# Altium schematic sheet Schematic_Rev13.SchDoc
size A2; Author: #; CompanyName: OMNITECH ELECTRONICS INCORPORATED; Engineer: SL; Organization: Omnitech Electronics Inc.; Address1: 10 Akerley Blvd, Dartmouth, Nova Scotia, Canada B3B 1J4; Address2: (902) 468-5911, FAX (902) 468-5911; Address3: www.omnitechelectronics.ca; Revision: A; SheetNumber: 1; SheetTotal: 1; PrjEngineer: SL; PrjStartDate: 04/11/2012; PrjDrawnBy: MR; PrjRevision: A; JobNumber: 2375; PrjTitle: Flow Rate Totalizing Meter; Title2: Display Board LED/Buttons; PrjCheckedBy: SL; PrjDocumentNumber: 2375-E-002; PageSetup: Record=PageOptions|CenterHorizontal=True|CenterVertical=True|PrintScale=0.67|XCorrection=1.00|YCorrection=1.00|PrintKind=1|BorderSize=5000000|LeftOffset=0|BottomOffset=0|Orientation=2|PaperLength=1000|PaperWidth=1000|Scale=100|PaperSource=257|PrintQuality=600|MediaType=1|DitherType=10|PaperKind=11x17|PrintScaleMode=1; PrjCustomer: Omnitech Inc.
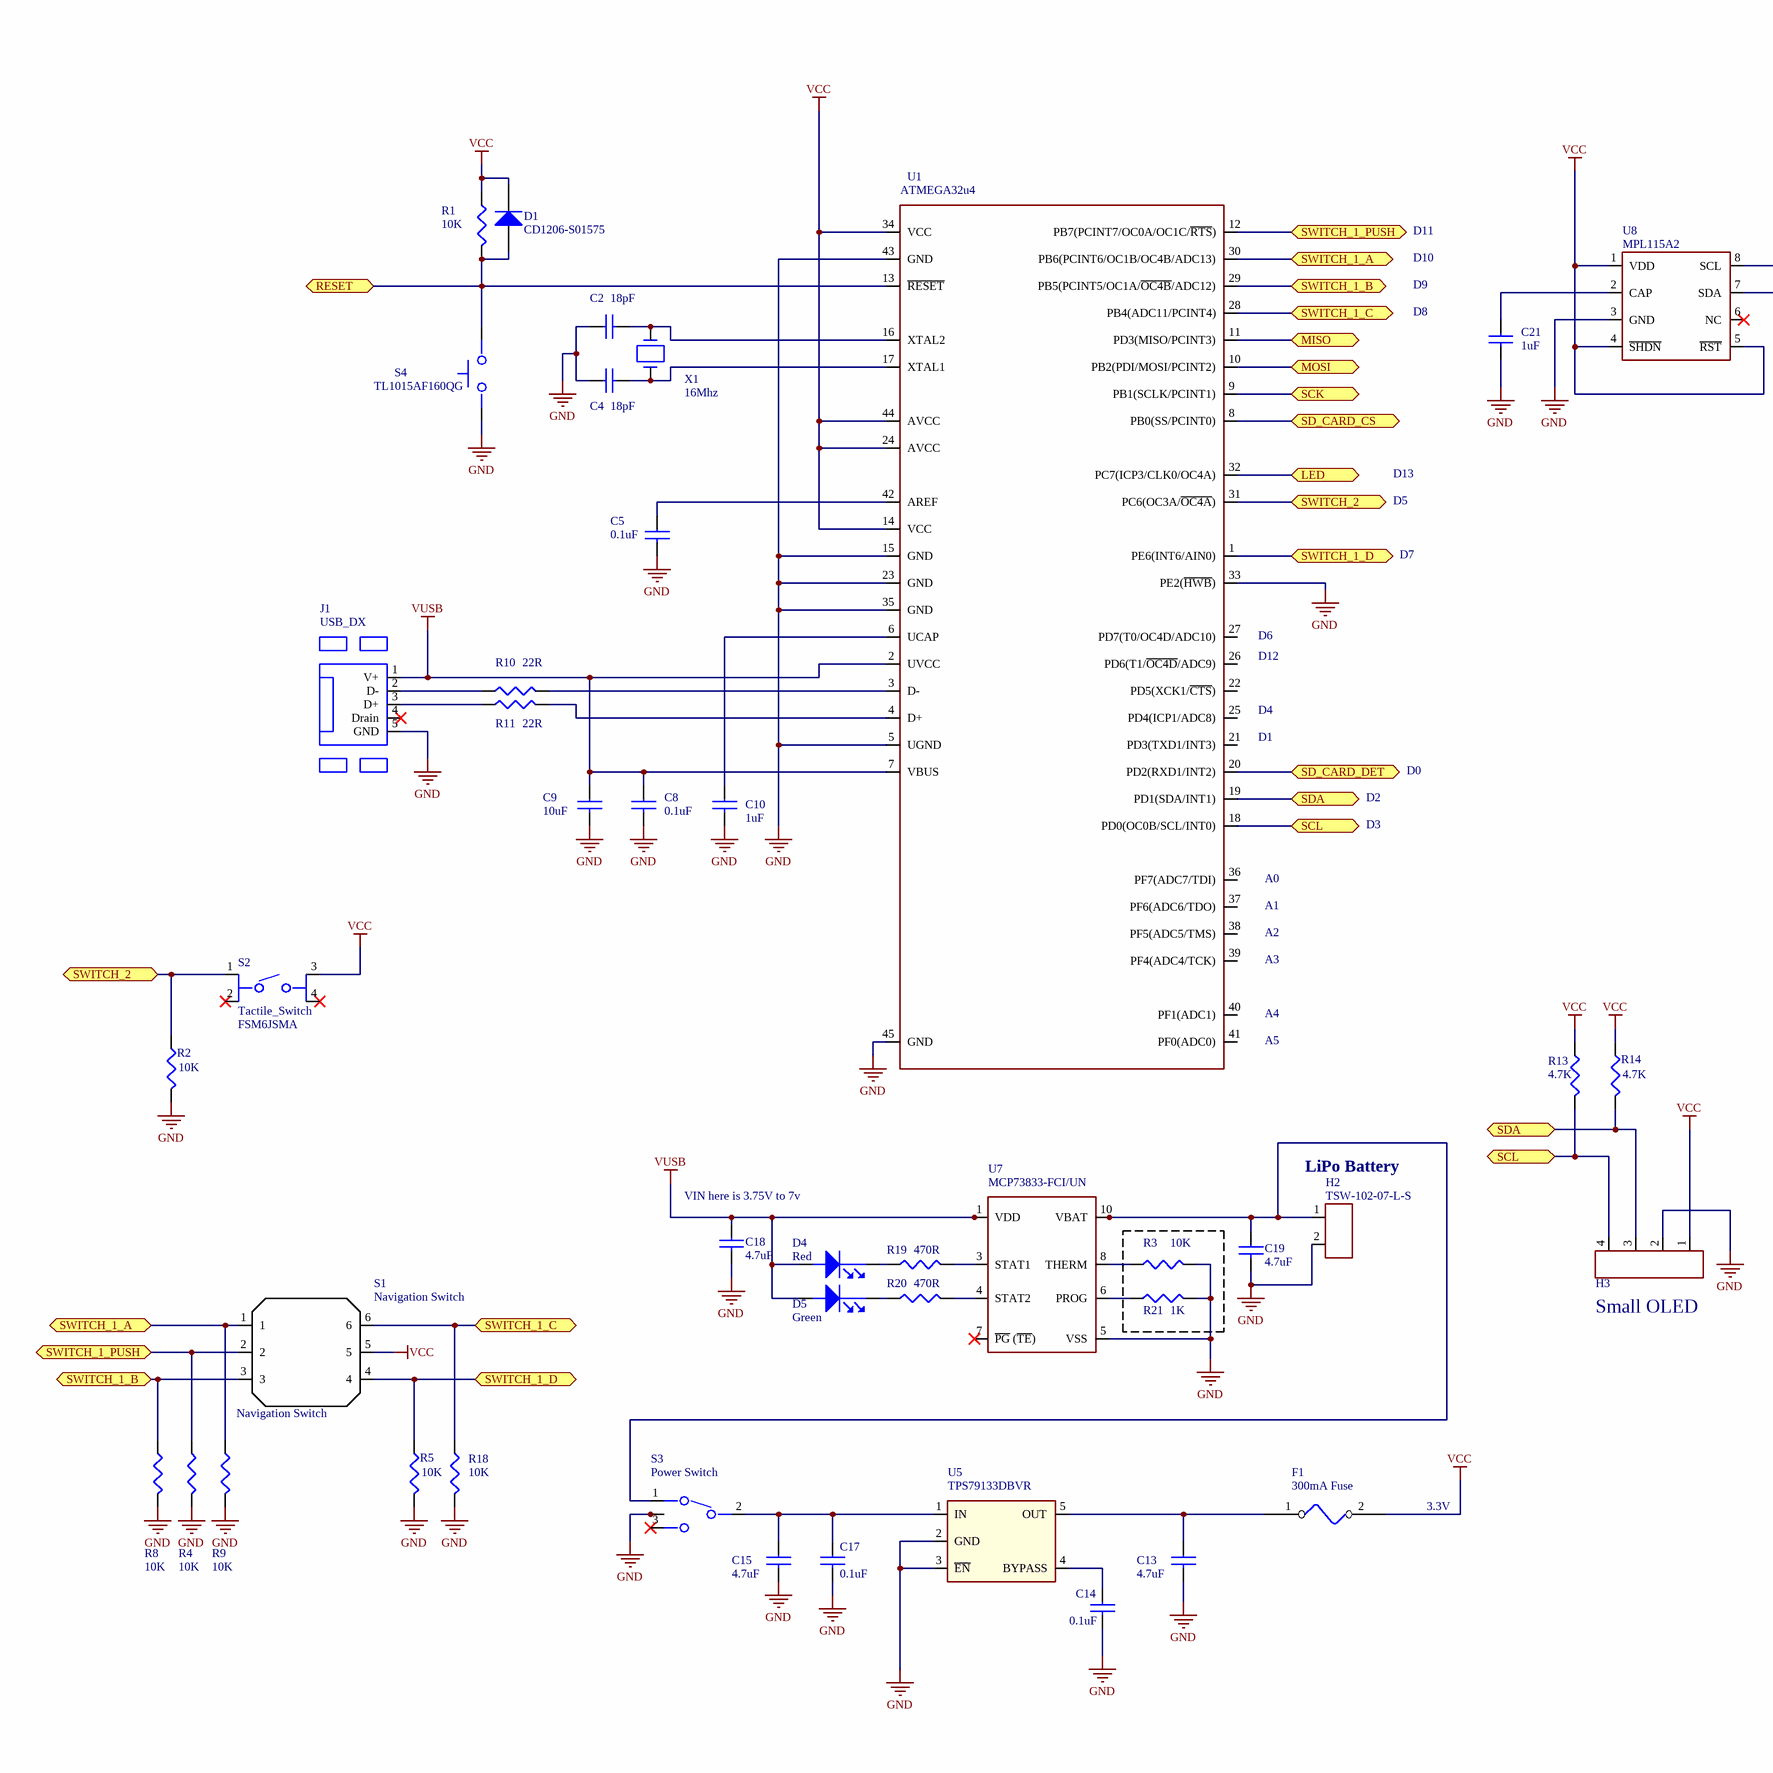
[diagram p0: Schematic_Rev13.SchDoc, left]
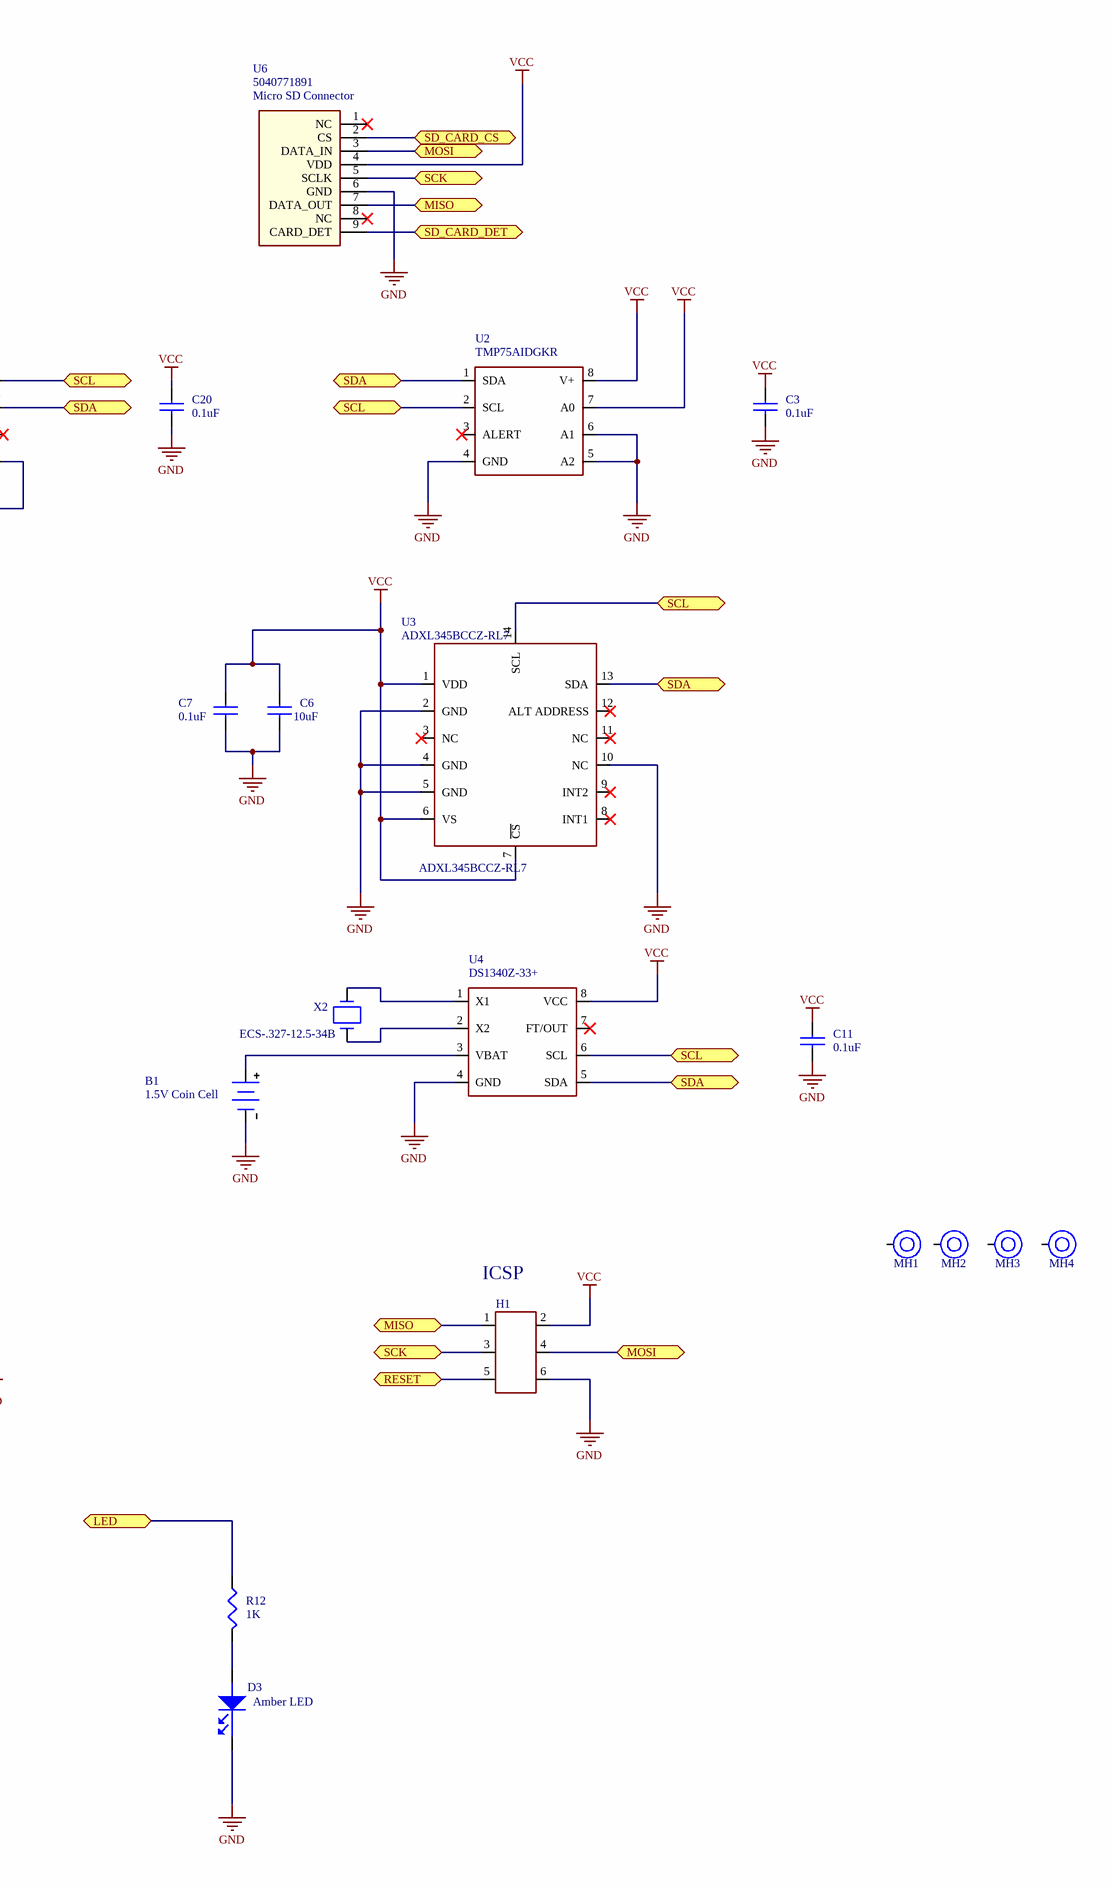
[diagram p1: Schematic_Rev13.SchDoc, right]

## Parts
B1  value 1.5V Coin Cell  [CR377 Mount]  (hidden comment: CR377)
C2  18pF  [CAPC1608X90N]
C3  0.1uF  [CAPC1608X90N]
C4  18pF  [CAPC1608X90N]
C5  0.1uF  [CAPC1608X90N]
C6  10uF  [CAPC3216X160N]
C7  0.1uF  [CAPC1608X90N]
C8  0.1uF  [CAPC1608X90N]
C9  10uF  [CAPC3216X160N]
C10  1uF  [CAPC1608X90N]
C11  0.1uF  [CAPC1608X90N]
C13  value 4.7uF  [CHIP_3216N]  (hidden comment: CAP_1206)
C14  0.1uF  [CHIP_1608N]
C15  value 4.7uF  [CHIP_3216N]  (hidden comment: CAP_1206)
C17  0.1uF  [CHIP_1608N]
C18  4.7uF  [CAPC3216X160N]
C19  4.7uF  [CAPC3216X160N]
C20  0.1uF  [CAPC1608X90N]
C21  1uF  [CAPC1608X90N]
D1  CD1206-S01575  [BOUR-CD1206-S01575-2_L]
D3  Amber LED  [LED1608X55N-RED]
D4  PartNumber: Red  [LED1608X55N-GREEN]  (hidden comment: LED_0603)
D5  PartNumber: Green  [LED1608X55N-GREEN]  (hidden comment: LED_0603)
F1  300mA Fuse  [RESC1608X55N]
H1  CON3X2  [HDR3X2]  (value not drawn)
H2  TSW-102-07-L-S  [HDR1X2]
H3  CON4  [HDR1X4-Empty]  (value not drawn)
J1  USB_DX  [USB_DX]
MH1  Mounting Hole  [MH - 128mil Hole, 250mil Pad]  (value not drawn)  (no BOM)
MH2  Mounting Hole  [MH - 128mil Hole, 250mil Pad]  (value not drawn)  (no BOM)
MH3  Mounting Hole  [MH - 128mil Hole, 250mil Pad]  (value not drawn)  (no BOM)
MH4  Mounting Hole  [MH - 128mil Hole, 250mil Pad]  (value not drawn)  (no BOM)
R1  10K  [RESC1608X55N]
R2  10K  [RESC1608X55N]
R3  10K  [RESC1608X55N]
R4  10K  [RESC1608X55N]
R5  10K  [RESC1608X55N]
R8  10K  [RESC1608X55N]
R9  10K  [RESC1608X55N]
R10  22R  [RESC1608X55N]
R11  22R  [RESC1608X55N]
R12  1K  [RESC1608X55N]
R13  4.7K  [RESC1608X55N]
R14  4.7K  [RESC1608X55N]
R18  10K  [RESC1608X55N]
R19  470R  [RESC1608X55N]
R20  470R  [RESC1608X55N]
R21  1K  [RESC1608X55N]
S1  Navigation Switch  [NAVIGATION - DX]
S2  Tactile_Switch  value FSM6JSMA  [FSM6JSMA]
S3  (no value)  [SLIDE_SWITCH_DX]
S4  TL1015AF160QG  [TL1015AF160QG]
U1  ATMEGA32u4  [VQFN-44]
U2  TMP75AIDGKR  [MSOP-8N - NOPAD]
U3  ADXL345BCCZ-RL7  [LGA80P300X500X100-14N]
U4  DS1340Z-33+  [TSOP65P490X110-8N]
U5  TPS79133DBVR  [SOT95P280X144-5N]
U6  Micro SD Connector  [5040771891]
U7  MCP73833-FCI/UN  [TSSOP50P490X110-10N]
U8  MPL115A2  [8-LGA]
X1  16Mhz  [OSC320X250X75-4N]
X2  ECS-.327-12.5-34B  [ECS-.327-12.5-34B]

## Ports
LED (bidir), MISO (bidir), MOSI (bidir), RESET (bidir), SCK (bidir), SCL (bidir), SD_CARD_CS (bidir), SD_CARD_DET (bidir), SDA (bidir), SWITCH_1_A, SWITCH_1_B, SWITCH_1_C, SWITCH_1_D, SWITCH_1_PUSH, SWITCH_2

## Nets
GND: B1.2(-) C2.1 C3.2 C4.1 C5.2 C6.2 C7.2 C8.2 C9.2 C10.2 C11.2 C13.2 C14.2 C15.2 C17.2 C18.2 C19.2 C20.2 C21.2 D3.1(CATHODE) H1.6 H2.2 H3.2 J1.5(GND) R2.2 R3.2 R4.2 R5.2 R8.2 R9.2 R18.2 R21.2 S3.4(GND) S3.5(GND) S4.1(A) U1.5(UGND) U1.15(GND) U1.23(GND) U1.33(PE2(~{HWB})) U1.35(GND) U1.43(GND) U1.45(GND) U2.4(GND) U2.5(A2) U2.6(A1) U3.2(GND) U3.4(GND) U3.5(GND) U3.10(NC) U4.4(GND) U5.2(GND) U5.3(~{EN}) U6.6(GND) U7.5(VSS) U8.3(GND)
VCC: C3.1 C6.1 C7.1 C11.1 C20.1 D1.2(K) F1.2 H1.2 H3.1 R1.1 R13.1 R14.1 S1.5 S2.3 U1.14(VCC) U1.24(AVCC) U1.34(VCC) U1.44(AVCC) U2.7(A0) U2.8(V+) U3.1(VDD) U3.6(VS) U3.7(~{CS}) U4.8(VCC) U6.4(VDD) U8.1(VDD) U8.4(~{SHDN}) U8.5(~{RST})
VUSB: C8.1 C9.1 C18.1 D4.2(ANODE) D5.2(ANODE) J1.1(V+) U1.2(UVCC) U1.7(VBUS) U7.1(VDD) U7.2(VDD)
LED: R12.1 U1.32(PC7(ICP3/CLK0/OC4A)) ; port LED
MISO: H1.1 U1.11(PD3(MISO/PCINT3)) U6.7(DATA_OUT) ; port MISO
MOSI: H1.4 U1.10(PB2(PDI/MOSI/PCINT2)) U6.3(DATA_IN) ; port MOSI
RESET: D1.1(A) H1.5 R1.2 S4.2(B) U1.13(~{RESET}) ; port RESET
SCK: H1.3 U1.9(PB1(SCLK/PCINT1)) U6.5(SCLK) ; port SCK
SCL: H3.4 R13.2 U1.18(PD0(OC0B/SCL/INT0)) U2.2(SCL) U3.14(SCL) U4.6(SCL) U8.8(SCL) ; port SCL
SD_CARD_CS: U1.8(PB0(SS/PCINT0)) U6.2(CS) ; port SD_CARD_CS
SD_CARD_DET: U1.20(PD2(RXD1/INT2)) U6.9(CARD_DET) ; port SD_CARD_DET
SDA: H3.3 R14.2 U1.19(PD1(SDA/INT1)) U2.1(SDA) U3.13(SDA) U4.5(SDA) U8.7(SDA) ; port SDA
SWITCH_1_A: R9.1 S1.1 U1.30(PB6(PCINT6/OC1B/OC4B/ADC13)) ; port SWITCH_1_A
SWITCH_1_B: R8.1 S1.3 U1.29(PB5(PCINT5/OC1A/~{OC4B}/ADC12)) ; port SWITCH_1_B
SWITCH_1_C: R18.1 S1.6 U1.28(PB4(ADC11/PCINT4)) ; port SWITCH_1_C
SWITCH_1_D: R5.1 S1.4 U1.1(PE6(INT6/AIN0)) ; port SWITCH_1_D
SWITCH_1_PUSH: R4.1 S1.2 U1.12(PB7(PCINT7/OC0A/OC1C/~{RTS})) ; port SWITCH_1_PUSH
SWITCH_2: R2.1 S2.1 U1.31(PC6(OC3A/~{OC4A})) ; port SWITCH_2
NetB1_1: B1.1(+) U4.3(VBAT)
NetC2_2: C2.2 U1.16(XTAL2) X1.3
NetC4_2: C4.2 U1.17(XTAL1) X1.1
NetC5_1: C5.1 U1.42(AREF)
NetC10_1: C10.1 U1.6(UCAP)
NetC13_1: C13.1 F1.1 U5.5(OUT)
NetC14_1: C14.1 U5.4(BYPASS)
NetC15_1: C15.1 C17.1 S3.2(Middle) U5.1(IN)
NetC19_1: C19.1 H2.1 S3.1(A) U7.9(VBAT) U7.10(VBAT)
NetC21_1: C21.1 U8.2(CAP)
NetD3_2: D3.2(ANODE) R12.2
NetD4_1: D4.1(CATHODE) R19.1
NetD5_1: D5.1(CATHODE) R20.1
NetJ1_2: J1.2(D-) R10.1
NetJ1_3: J1.3(D+) R11.1
NetR3_1: R3.1 U7.8(THERM)
NetR10_2: R10.2 U1.3(D-)
NetR11_2: R11.2 U1.4(D+)
NetR19_2: R19.2 U7.3(STAT1)
NetR20_2: R20.2 U7.4(STAT2)
NetR21_1: R21.1 U7.6(PROG)
NetU4_1: U4.1(X1) X2.1
NetU4_2: U4.2(X2) X2.2

Not connected (* = marked no-connect by the designer): J1 4(Drain)*; MH1 1; MH2 1; MH3 1; MH4 1; S2 2* 4*; S3 3(B)*; U1 21(PD3(TXD1/INT3)) 22(PD5(XCK1/~{CTS})) 25(PD4(ICP1/ADC8)) 26(PD6(T1/~{OC4D}/ADC9)) 27(PD7(T0/OC4D/ADC10)) 36(PF7(ADC7/TDI)) 37(PF6(ADC6/TDO)) 38(PF5(ADC5/TMS)) 39(PF4(ADC4/TCK)) 40(PF1(ADC1)) 41(PF0(ADC0)); U2 3(ALERT)*; U3 3(NC)* 8(INT1)* 9(INT2)* 11(NC)* 12(ALT_ADDRESS)*; U4 7(FT/OUT)*; U6 1(NC)* 8(NC)*; U7 7(~{PG}_(~{TE}))*; U8 6(NC)*

## Notes on the sheet
- D11
- D10
- D9
- D8
- D13
- D5
- D7
- (near U1) D6
- (near U1) D12
- (near U1) D4
- (near U1) D1
- D0
- D2
- D3
- (near U1) A0
- (near U1) A1
- (near U1) A2
- (near U1) A3
- (near U1) A4
- (near U1) A5
- (near H2) LiPo Battery
- (near H1) ICSP
- (near C18) VIN here is 3.75V to 7v
- (near H3) Small OLED
- (near S3) Power Switch
- 3.3V

## Library data of the parts
B1 = CR377: Custom CR377 mount; Manufacturer: Sunbeam; Vendor: DX
C2 C4 = CAP_0603: CAP CER 18pF 0603; Value: 18pF
C3 C5 C7 C11 = CAP_0603: CAP CER 0.1uF 0603; Value: 0.1uF
C6 C9 = GRM31CR61E106KA12L: CAP CER 10UF 25V 10% X5R 1206; Manufacturer: Murata; PartNumber: GRM31CR61E106KA12L; Value: 10uF
C8 C20 C21 = CAP_0603: CAP 0603
  C8 C20: Value: 0.1uF
  C21: Value: 1uF
C10 = CAP_0603: CAP CER 1uF 0603; Value: 1uF
C13 C15 C18 C19 = CAP_1206: CAP CER 4.7uF, 1206
  C18 C19: Value: 4.7uF
C14 C17 = CAP_0603: CAP CER 0.1uF, 0603; Value: 0.1uF
D1 = CMP-0583-00001-2: 75 V Small Signal Switching Diode, 150 mA, 2.5 uA, 1026 Molded Package, RoHS, Tape and Reel; Manufacturer: Bourns; Reverse Voltage: 75 V; Average Forward Current: 150 mA; Reverse Current (Max.): 2.5 uA; Capacitance Between Terminals (Max.): 3 pF; Reverse Recovery Time (Max.): 4 nS; Forward Voltage (Max.): 1.00 V; Packing: Tape and Reel; Mounting Technology: Surface Mount; DatasheetVersion: Rev. 06/11; ComponentLink2URL: http://www.bourns.com/data/global/pdfs/CD1206_S01575.pdf; PackageReference: CD1206-S01575-2; RoHS: TRUE; ComponentLink1URL: http://www.bourns.com/; ComponentLink1Description: Manufacturer URL; ComponentLink3Description: Package Specification; ComponentLink3URL: http://www.bourns.com/data/global/pdfs/CD1206_S01575.pdf; ComponentLink2Description: Datasheet; PackageDescription: 2-Pin SMD, Body 3.2 x 1.5 mm; PartNumber: CD1206-S01575
D3 = LED_0603: Value: Amber LED
F1 = MF-FSMF010X-2: FUSE .3A 125V FAST NANO2 SMD; Manufacturer: Bourns; PartNumber: MF-FSMF010X-2; Value: 300mA Fuse
H1 = CON3X2: CONN HEADER 3X2POS .100" PADS; PartNumber: PADS
H2 = TSW-102-07-L-S: CONN HEADER 2POS .100" SGL GOLD; Available From: Samtec; Data Sheet: http://www.samtec.com/ProductInformation/TechnicalSpecifications/Overview.aspx?series=TSW; Exact Part Number: TSW-102-07-L-S; Manufacturer: Samtec; Operating Temp: *; Order Part Number: TSW-102-07-L-S; Price: $0.51; ROHS Compliant: Yes; Voltage/Pwr: *
H3 = CON4: CONN HEADER 4POS .100" PADS; PartNumber: PADS
J1 = USB_DX: CONN RECEPT MINIUSB R/A 5POS SMD; Vendor: Digikey; PartNumber: USB_DX; Value: USB_DX
R1 R2 R4 R5 R8 R9 R13 R14 R18 = RES_0603: RES 10K 0603
  R1 R2 R4 R5 R8 R9 R18: Value: 10K
  R13 R14: Value: 4.7K
R3 = RES_0603: RES 10K 0603; PartNumber: ERJ-3EKF1002V; Value: 10K
R10 R11 = RES_0603: RES 33R 0603; Value: 22R
R12 = RES_0603: RES 1K 0603; Value: 1K
R19 R20 = RES_0603: Value: 470R
R21 = RES_0603: RES 1K 0603; PartNumber: ERJ-3GEYJ102V; Value: 1K
S1 = NAV-DX: Navigation Switch - DX; PartNumber: NAV-DX; Value: Navigation Switch
S2 = FSM6JSMA: SWITCH TACTILE SPST-NO 0.05A 12V; Manufacturer: TE Connectivity; Vendor: Digikey; PartNumber: FSM6JSMA
S3 = DX_SLIDE_SWITCH: DX_SWITCH SLIDE SPDT R/A; PartNumber: 122531; Vendor: Digikey; Value: DX_SLIDE_SWITCH
S4 = TL1015AF160QG: SWITCH TACTILE SPST-NO 0.05A 12V; Manufacturer: E-Switch; PartNumber: TL1015AF160QG; Value: TL1015AF160QG
U1 = ATmega32U4: MCU AVR 32K FLASH 16MHZ 44-TQFP; PartNumber: ATMEGA32U4-AU; Manufacturer: Atmel; Vendor: Digikey; Value: ATMEGA32u4
U2 = TMP75AIDGKR: IC DGTL TEMP SENSOR 2WIRE 8-MSOP; Manufacturer: Maxim; PartNumber: TMP75AIDGKR; Value: TMP75AIDGKR
U3 = ADXL345BCCZ-RL7: IC ACCEL SPI/I2C 3AX 14LGA; Manufacturer: Analog Devices; PartNumber: ADXL345BCCZ-RL7; Value: ADXL345BCCZ-RL7
U4 = DS1340Z-33+: IC RTC SERIAL 512K 8-TSSOP; Manufacturer: Maxim; PartNumber: DS1340Z-33+; Value: DS1340Z-33+
U5 = TPS79133DBVR: IC REG LDO 3.3V 0.1A SOT23-5; Manufacturer: Texas Instruments; Vendor: Digikey; Value: TPS79133DBVR; PartNumber: TPS79133DBVR
U6 = 5040771891: CONN MICRO SD CARD PUSH-PULL SMD; Manufacturer: Molex; Vendor: Digikey; PartNumber: 5040771891; Value: Micro SD Connector
U7 = MCP73833-FCI/UN: IC LI-ION/LI-POLY CTRLR 10MSOP; Manufacturer: Microchip; Vendor: Digikey; PartNumber: MCP73833-FCI/UN
U8 = MPL115A2: IC BAROMETER I2C DGTL MINI 8-LGA; Manufacturer: Freescale; PartNumber: MPL115A2; Value: MPL115A2
X1 = ABM8-16.000MHZ-B2-T: CRYSTAL 16.000MHZ 18PF SMD; Manufacturer: Abracon; PartNumber: ABM8-16.000MHZ-B2-T; Value: 16Mhz
X2 = ECS-.327-12.5-34B: CRYSTAL 32.768 KHZ 12.5PF SMD; Manufacturer: ECS; PartNumber: ECS-.327-12.5-34B; Value: ECS-.327-12.5-34B
MH1-MH4 = Mounting Hole: Available From: N/A; Data Sheet: N/A; Exact Part Number: N/A; Manufacturer: N/A; Operating Temp: N/A; Order Part Number: N/A; ROHS Compliant: N/A; Voltage/Pwr: N/A; Price: N/A